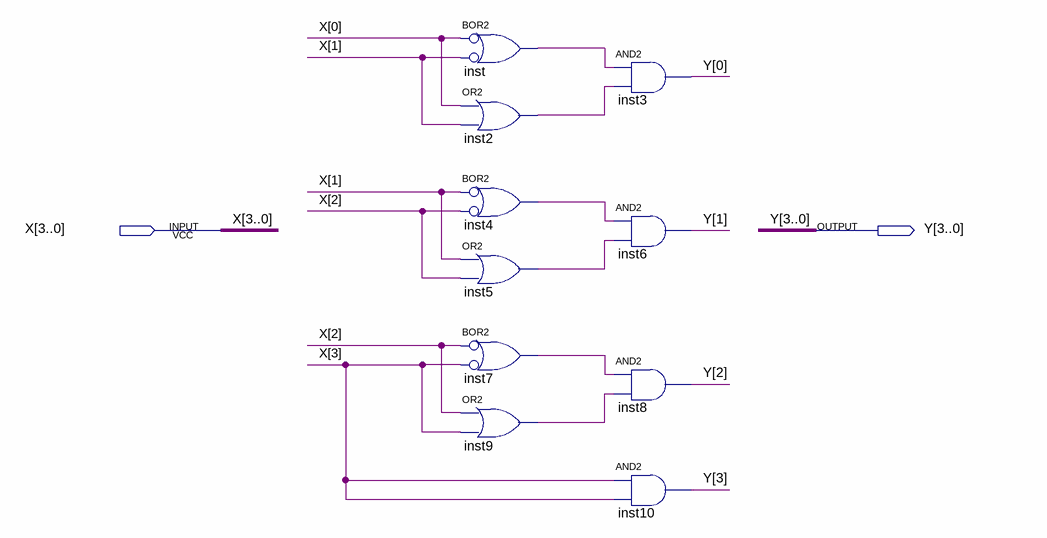
[diagram p0: schematic sheet]
// Quartus schematic lab03.bdf as structural Verilog: 10 symbols, 2 pins
module lab03 (
  input  [3:0] X,
  output [3:0] Y
);

  wire inst2_out, inst4_out, inst5_out, inst7_out, inst9_out, inst_out;

  or inst (inst_out, ~X[0], ~X[1]);  // BOR2
  or inst2 (inst2_out, X[0], X[1]);
  or inst4 (inst4_out, ~X[1], ~X[2]);  // BOR2
  or inst5 (inst5_out, X[1], X[2]);
  or inst7 (inst7_out, ~X[2], ~X[3]);  // BOR2
  or inst9 (inst9_out, X[2], X[3]);
  and inst3 (Y[0], inst_out, inst2_out);
  and inst6 (Y[1], inst4_out, inst5_out);
  and inst8 (Y[2], inst7_out, inst9_out);
  and inst10 (Y[3], X[3], X[3]);
endmodule
